# EAGLE design MiniSumoMotors (EAGLE 9.6.2)
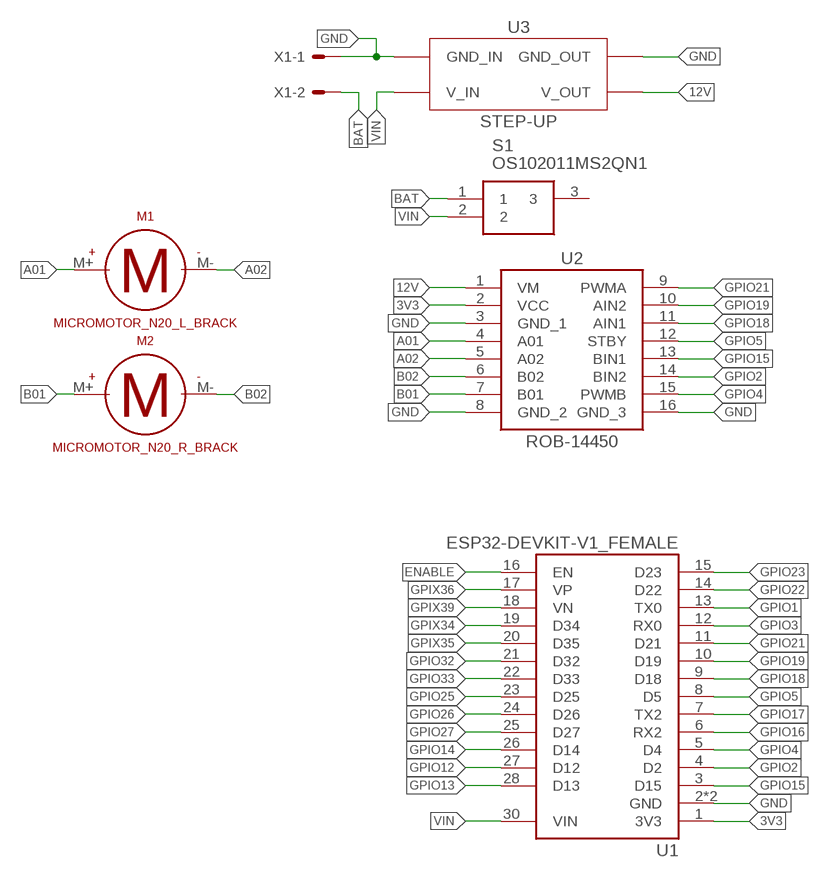
[diagram p0: schematic, sheet 1]

## Parts
M1  MICROMOTOR_N20_L_BRACK  [MICROMOTOR-L_BRACK]
M2  MICROMOTOR_N20_R_BRACK  [MICROMOTOR-R_BRACK]
S1  OS102011MS2QN1  [OS102011MA1QN1]
U1  ESP32-DEVKIT-V1_FEMALE  [MODULE_ESP32_DEVKIT_V1_FEMALE]
U2  ROB-14450  [ROB14450]
U3  STEP-UP  [STEP-UP]
X1  22-23-2021  [22-23-2021]

## Nets
3V3: U1.1(3V3) U2.2(VCC)
12V: U2.1(VM) U3.V_OUT
A01: M1.M+ U2.4(A01)
A02: M1.M- U2.5(A02)
B01: M2.M+ U2.7(B01)
B02: M2.M- U2.6(B02)
BAT: S1.1 X1.2
ENABLE: U1.16(EN)
GND: U1.2(GND) U1.29(GND) U2.3(GND_1) U2.8(GND_2) U2.16(GND_3) U3.GND_IN U3.GND_OUT X1.1
GPIO1: U1.13(TX0)
GPIO2: U1.4(D2) U2.14(BIN2)
GPIO3: U1.12(RX0)
GPIO4: U1.5(D4) U2.15(PWMB)
GPIO5: U1.8(D5) U2.12(STBY)
GPIO12: U1.27(D12)
GPIO13: U1.28(D13)
GPIO14: U1.26(D14)
GPIO15: U1.3(D15) U2.13(BIN1)
GPIO16: U1.6(RX2)
GPIO17: U1.7(TX2)
GPIO18: U1.9(D18) U2.11(AIN1)
GPIO19: U1.10(D19) U2.10(AIN2)
GPIO21: U1.11(D21) U2.9(PWMA)
GPIO22: U1.14(D22)
GPIO23: U1.15(D23)
GPIO25: U1.23(D25)
GPIO26: U1.24(D26)
GPIO27: U1.25(D27)
GPIO32: U1.21(D32)
GPIO33: U1.22(D33)
GPIX34: U1.19(D34)
GPIX35: U1.20(D35)
GPIX36: U1.17(VP)
GPIX39: U1.18(VN)
VIN: S1.2 U1.30(VIN) U3.V_IN
Unconnected: S1.3

## Library data of the parts
M1 M2 = Boards:MICROMOTOR_N20
S1 = Buttons:OS102011MS2QN1: Switch Slide Miniature SPDT 0.1A 12VDC Through Hole Slide Switch SPDT On-On 0.1 A@ 12 V dc Slide Source: Datasheet <http://www.ckswitches.com/media/1428/os.pdf>; ALLIED_NUMBER: 70272264; ALLIED_PRICE-STOCK: https://www.alliedelec.com/c-k-os102011ms2qn1/70272264/; ARROW_PART_NUMBER: OS102011MS2QN1; ARROW_PRICE-STOCK: https://www.arrow.com/en/products/os102011ms2qn1/ck; DESCRIPTION: Switch Slide Miniature SPDT 0.1A 12VDC Through Hole Slide Switch SPDT On-On 0.1 A@ 12 V dc Slide; HEIGHT: mm; MANUFACTURER_NAME: C & K COMPONENTS; MANUFACTURER_PART_NUMBER: OS102011MS2QN1; RS_PART_NUMBER: 7874864; RS_PRICE-STOCK: http://uk.rs-online.com/web/p/products/7874864
U1 = Boards:ESP32-DEVKIT-V1: Dual core, Wi-Fi: 2.4 GHz up to 150 Mbits/s,BLE (Bluetooth Low Energy) and legacy Bluetooth, 32 bits, Up to 240 MHz Check availability <https://pricing.snapeda.com/parts/ESP32-DEVKIT-V1/Do%20it/view-part?ref=eda>
U2 = Boards:ROB-14450: Power Management IC Development Tools SparkFun MotorDriver Dual TB6612FNG Head. Source: Datasheet <https://www.sparkfun.com/products/14450>; ARROW_PART_NUMBER: ROB-14450; ARROW_PRICE-STOCK: https://www.arrow.com/en/products/rob-14450/sparkfun-electronics?region=nac; DESCRIPTION: Power Management IC Development Tools SparkFun MotorDriver Dual TB6612FNG Head.; HEIGHT: 5mm; MANUFACTURER_NAME: SparkFun; MANUFACTURER_PART_NUMBER: ROB-14450; MOUSER_PART_NUMBER: 474-ROB-14450; MOUSER_PRICE-STOCK: https://www.mouser.co.uk/ProductDetail/SparkFun/ROB-14450?qs=wd5RIQLrsJhQdlH%2FW5H2aQ%3D%3D
U3 = Boards:STEP-UP
X1 = Pines:22-23-2021: .100" (2.54mm) Center Header - 2 Pin; MF: MOLEX; MPN: 22-23-2021; OC_FARNELL: 1462926; OC_NEWARK: 25C3832

## Board
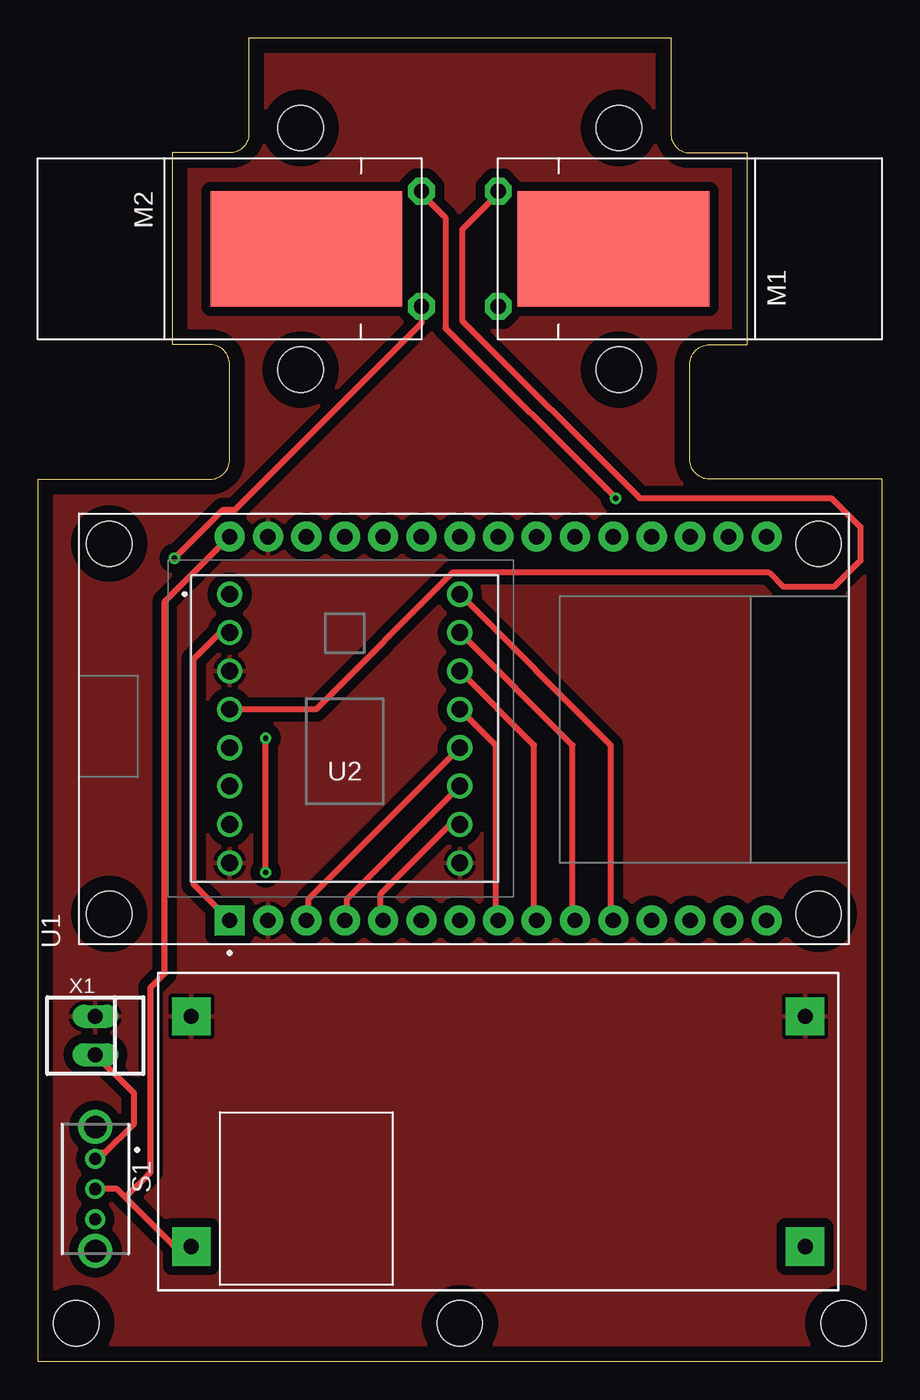
[diagram p1: board, top side]
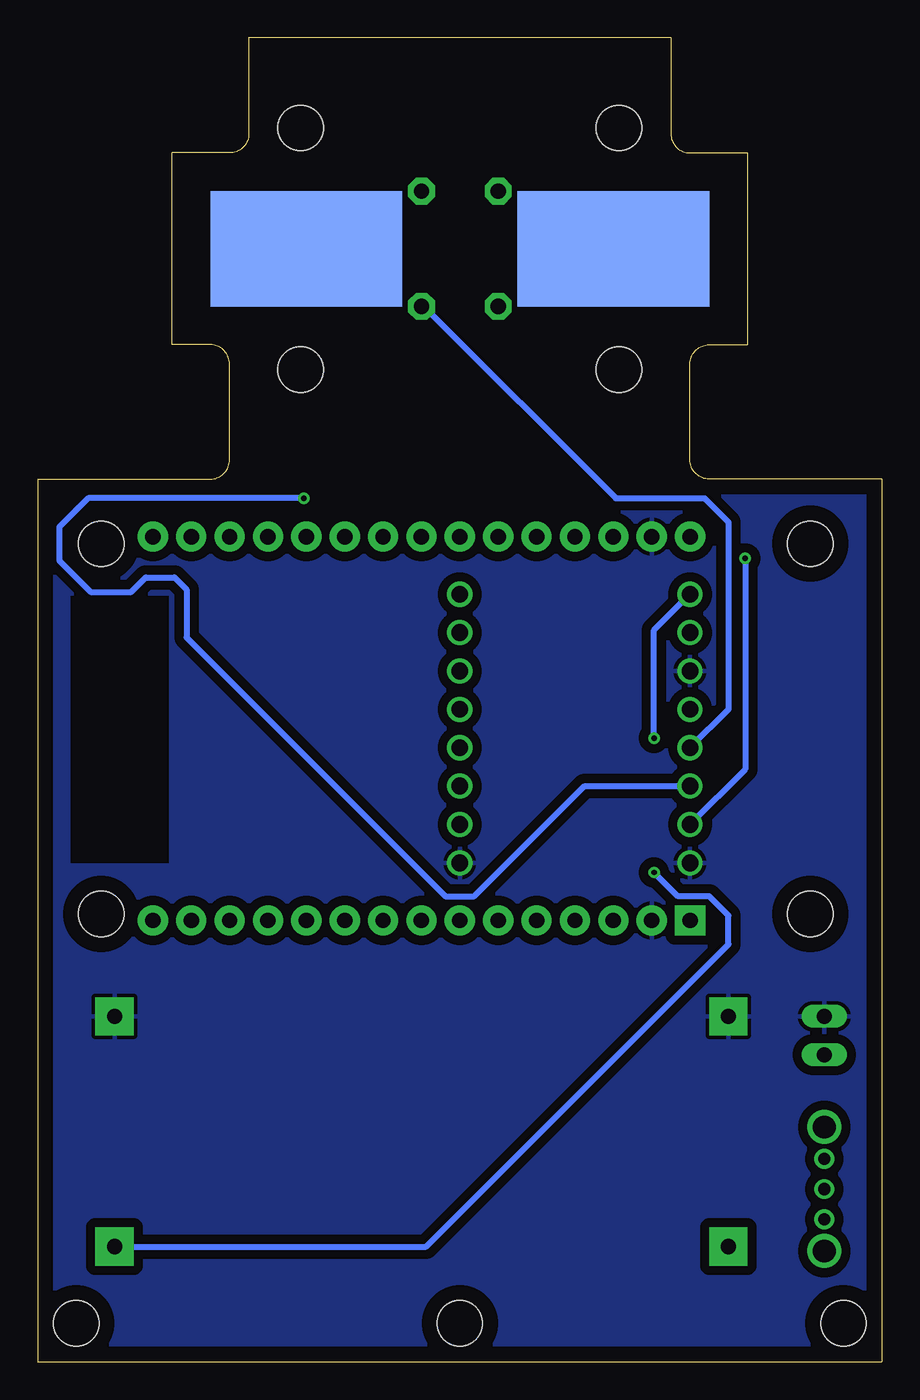
[diagram p2: board, bottom side, seen from below]

Size 55.88 x 87.63 mm. Coordinates in mm from the lower left corner, seen from the top.
Outline: 13.97,87.63 41.91,87.63 41.91,81.28 arc90 43.18,80.01 46.99,80.01 46.99,67.31 44.45,67.31 arc90 43.18,66.04 43.18,59.69 arc90 44.45,58.42 55.88,58.42 55.88,0 0,0 0,58.42 11.43,58.42 arc90 12.7,59.69 12.7,66.04 arc90 11.43,67.31 8.89,67.31 8.89,80.01 12.7,80.01 arc90 13.97,81.28 13.97,87.63
Copper layers (1*16): Top 0.035mm / dielectric 1.5mm / Bottom 0.035mm
Design rules "default *": minimum track width 16mil, minimum drill 0.35mm, track to track 24mil, track to pad 12mil, pad to pad 12mil, via to via 6mil, smd to smd 6mil, copper to edge 40mil, drill to drill 6mil, minimum pad ring 10mil, minimum via ring 8mil, stop-mask expansion 4mil, vias tented up to drill 0mil, thermal gap 10mil
Holes 3 mm at 53.34,2.54 2.54,2.54 27.94,2.54

### Footprints (pad centres in the part's own frame; a part is rotated, then mirrored left to right if it is on the bottom)
MICROMOTOR-L_BRACK = smd 12.7 x 7.62 bottom: ARMOR-D 7.62,0 | smd 12.7 x 7.62: ARMOR-T 7.62,0 | drill 1 pad 1.778 octagon: M+ 0,3.81; M- 0,-3.81 | hole 3: 8,8; 8,-8
MICROMOTOR-R_BRACK = smd 12.7 x 7.62 bottom: ARMOR-B 7.62,0 | smd 12.7 x 7.62: ARMOR-T 7.62,0 | drill 1 pad 1.778 octagon: M+ 0,3.81; M- 0,-3.81 | hole 3: 8,8; 8,-8
OS102011MA1QN1 = drill 0.8 pad 1.3: 1 -2,0; 2 0,0; 3 2,0 | drill 1.5 pad 2.25: 4 -4.1,0; 5 4.1,0
MODULE_ESP32_DEVKIT_V1_FEMALE = drill 1.02 pad 2 square: 1 12.7,-15.24 | drill 1.02 pad 2: 2 12.7,-12.7; 3 12.7,-10.16; 4 12.7,-7.62; 5 12.7,-5.08; 6 12.7,-2.54; 7 12.7,0; 8 12.7,2.54; 9 12.7,5.08; 10 12.7,7.62; 11 12.7,10.16; 12 12.7,12.7; 13 12.7,15.24; 14 12.7,17.78; 15 12.7,20.32; 16 -12.7,20.32; 17 -12.7,17.78; 18 -12.7,15.24; 19 -12.7,12.7; 20 -12.7,10.16; 21 -12.7,7.62; 22 -12.7,5.08; 23 -12.7,2.54; 24 -12.7,0; 25 -12.7,-2.54; 26 -12.7,-5.08; 27 -12.7,-7.62; 28 -12.7,-10.16; 29 -12.7,-12.7; 30 -12.7,-15.24 | hole 3: 12.28,23.75; -12.23,23.75; -12.23,-23.2; 12.28,-23.2
ROB14450 = drill 1.11 pad 1.665: 1 -7.62,8.89; 2 -7.62,6.35; 3 -7.62,3.81; 4 -7.62,1.27; 5 -7.62,-1.27; 6 -7.62,-3.81; 7 -7.62,-6.35; 8 -7.62,-8.89; 9 7.62,8.89; 10 7.62,6.35; 11 7.62,3.81; 12 7.62,1.27; 13 7.62,-1.27; 14 7.62,-3.81; 15 7.62,-6.35; 16 7.62,-8.89
STEP-UP = drill 1 pad 2.54 square: GND_IN -20.32,7.62; GND_OUT 20.32,7.62; V_IN -20.32,-7.62; V_OUT 20.32,-7.62
22-23-2021 = drill 1 long: 1 -1.27,0; 2 1.27,0

### Placement (x,y rotation side)
M1  30.48,73.66 0 top
M2  25.4,73.66 180 top
S1  3.81,11.43 270 top
U1  27.94,41.91 270 top
U2  20.32,41.91 0 top
U3  30.48,15.24 0 top
X1  3.81,21.59 270 top

### Tracks (layer width: path | path; a pad name or v marks a point on that pad's centre or on a via)
3V3
  Top 0.406: U2.2 12.06,48.26 10.32,46.51 10.32,31.59 U1.1
12V  (via drill 0.35)
  Top 0.406: v15.08,32.38 v15.08,41.27
  Bottom 0.406: U2.1 15.08,48.42 v15.08,41.27 | v15.08,32.38 13.49,30.8 11.43,30.8 10.16,29.53 10.16,27.62 30.16,7.62 U3.V_OUT
A01
  Top 0.406: U2.4 18.41,43.18 27.46,52.23 48.42,52.23 49.37,51.28 52.7,51.28 54.45,53.02 54.45,55.24 52.55,57.15 39.85,57.15 28.1,68.9 28.1,74.93 30.48,77.31 M1.M+
A02
  Bottom 0.406: U2.5 10.16,43.18 10.16,55.56 11.75,57.15 17.62,57.15 30.32,69.85 M1.M-
B01  (via drill 0.35)
  Top 0.406: v9.05,53.18 12.22,56.36 13.02,56.36 25.4,68.74 M2.M+
  Bottom 0.406: U2.7 9.05,39.21 v9.05,53.18
B02  (via drill 0.35)
  Top 0.406: v38.26,57.15 26.99,68.42 26.99,75.72 25.4,77.31 M2.M-
  Bottom 0.406: U2.6 19.68,38.1 26.99,30.8 28.89,30.8 46.04,47.94 46.04,51.12 46.83,51.91 48.74,51.91 49.69,50.96 52.39,50.96 54.45,53.02 54.45,55.24 52.55,57.15 v38.26,57.15
BAT
  Top 0.406: X1.2 6.35,17.78 6.35,15.72 4.44,13.81 4.13,13.81 3.81,13.49 S1.1
GND
  pour Top: -0.13,-0.13 56.01,-0.13 56.01,58.55 43.31,58.55 43.31,65.91 43.31,67.18 46.99,67.18 47.12,67.18 47.12,68.2 47.12,80.14 43.18,80.14 42.04,80.14 42.04,87.76 13.84,87.76 13.84,81.41 13.84,80.14 8.76,80.14 8.76,67.18 11.3,67.18 12.57,67.18 12.57,64.39 12.57,58.55 -0.13,58.55
  pour Bottom: -0.25,-0.25 56.13,-0.25 56.13,58.67 44.2,58.67 43.43,58.67 43.43,67.06 47.24,67.06 47.24,80.26 42.16,80.26 42.16,87.88 13.72,87.88 13.72,80.26 8.64,80.26 8.64,76.58 8.64,67.06 12.45,67.06 12.45,58.67 -0.25,58.67
GPIO2
  Top 0.406: U2.14 20.48,30.64 20.48,29.37 U1.4
GPIO4
  Top 0.406: U2.15 27.3,35.56 22.7,30.96 22.7,29.37 U1.5
GPIO5
  Top 0.406: U2.12 30.32,40.8 30.32,29.37 U1.8
GPIO15
  Top 0.406: U2.13 17.94,30.64 17.94,29.37 U1.3
GPIO18
  Top 0.406: U2.11 32.86,40.8 32.86,29.37 U1.9
GPIO19
  Top 0.406: U2.10 35.4,40.8 35.4,29.37 U1.10
GPIO21
  Top 0.406: U2.9 37.94,40.8 37.94,29.37 U1.11
VIN
  Top 0.406: S1.2 5.24,11.43 5.79,10.87 | 5.79,10.87 9.05,7.62 U3.V_IN | U1.30 8.41,50.32 8.41,25.72 7.46,24.77 7.46,12.54 5.79,10.87